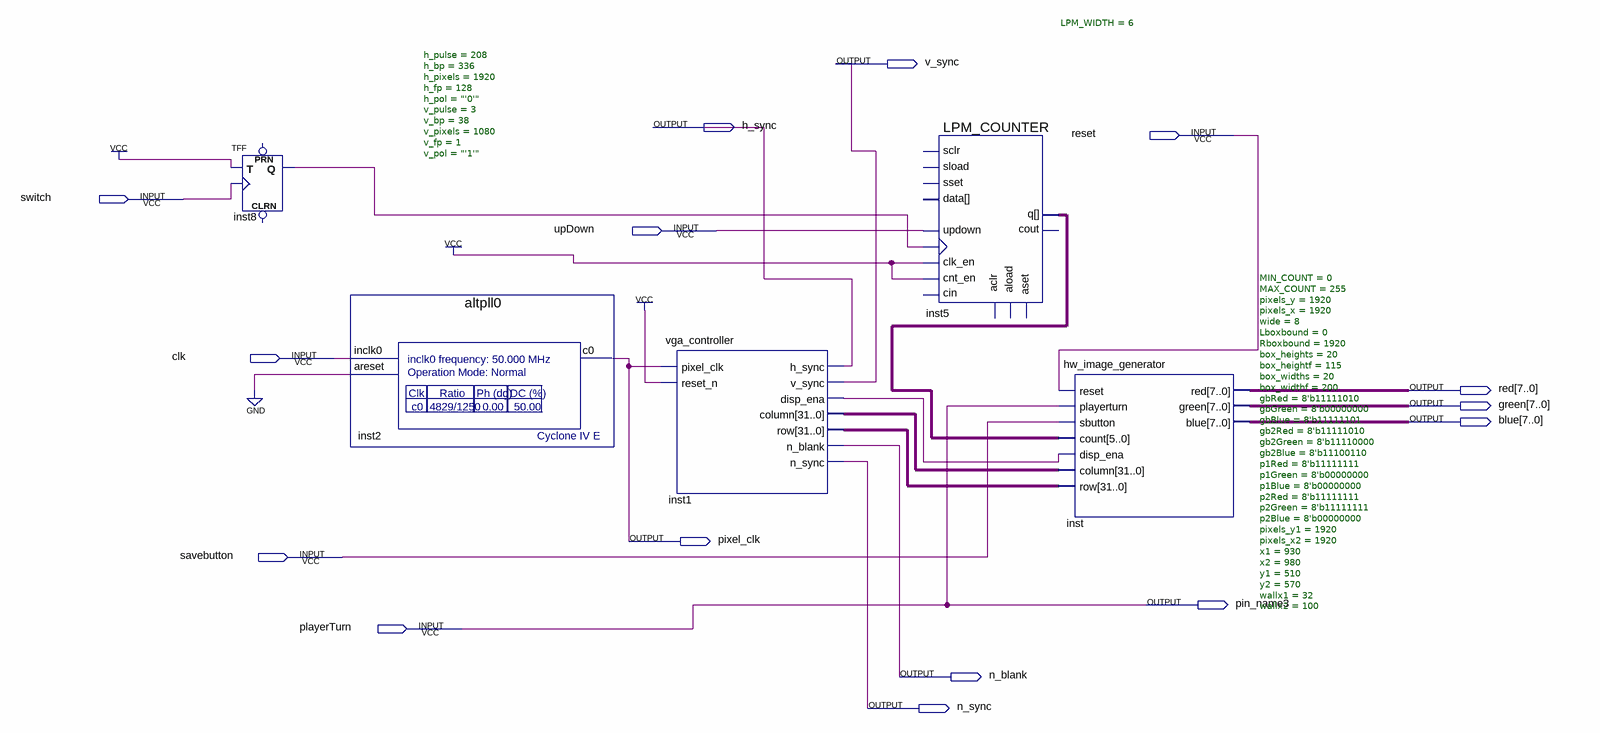
[diagram p0: schematic sheet]
// Quartus schematic vga_with_hw_test_image.bdf as structural Verilog: 5 symbols, 15 pins
module vga_with_hw_test_image (
  input  reset,
  input  switch,
  input  upDown,
  input  clk,
  input  savebutton,
  input  playerTurn,
  output v_sync,
  output h_sync,
  output [7:0] red,
  output [7:0] green,
  output [7:0] blue,
  output pixel_clk,
  output pin_name3,
  output n_blank,
  output n_sync
);

  wire inst1_disp_ena, inst8_q;
  wire [5:0] inst5_q;
  wire [31:0] inst1_column, inst1_row;

  TFF inst8 (.T(1'b1), .CLK(switch), .Q(inst8_q));  // open: PRN, CLRN
  altpll0 inst2 (.inclk0(clk), .areset(1'b0), .c0(pixel_clk));
  vga_controller #(.h_pulse(208), .h_bp(336), .h_pixels(1920), .h_fp(128), .h_pol("'0'"), .v_pulse(3), .v_bp(38), .v_pixels(1080), .v_fp(1), .v_pol("'1'")) inst1 (
    .pixel_clk(pixel_clk), .reset_n(1'b1), .h_sync(h_sync), .v_sync(v_sync), .disp_ena(inst1_disp_ena),
    .column(inst1_column), .row(inst1_row), .n_blank(n_blank), .n_sync(n_sync));
  LPM_COUNTER #(.LPM_WIDTH(6)) inst5 (
    .clock(inst8_q), .clk_en(1'b1), .updown(upDown), .cnt_en(1'b1), .q(inst5_q));  // open: sload, data, aload, aclr, aset, cin, sset, sclr, cout
  hw_image_generator #(.MIN_COUNT(0), .MAX_COUNT(255), .pixels_y(1920), .pixels_x(1920), .wide(8), .Lboxbound(0), .Rboxbound(1920), .box_heights(20), .box_heightf(115), .box_widths(20), .box_widthf(200), .gbRed(8'b11111010), .gbGreen(8'b00000000), .gbBlue(8'b11111101), .gb2Red(8'b11111010), .gb2Green(8'b11110000), .gb2Blue(8'b11100110), .p1Red(8'b11111111), .p1Green(8'b00000000), .p1Blue(8'b00000000), .p2Red(8'b11111111), .p2Green(8'b11111111), .p2Blue(8'b00000000), .pixels_y1(1920), .pixels_x2(1920), .x1(930), .x2(980), .y1(510), .y2(570), .wallx1(32), .wallx2(100)) inst (
    .reset(reset), .playerturn(playerTurn), .sbutton(savebutton), .count(inst5_q), .disp_ena(inst1_disp_ena),
    .column(inst1_column), .row(inst1_row), .red(red), .green(green), .blue(blue));

  assign pin_name3 = playerTurn;
endmodule
